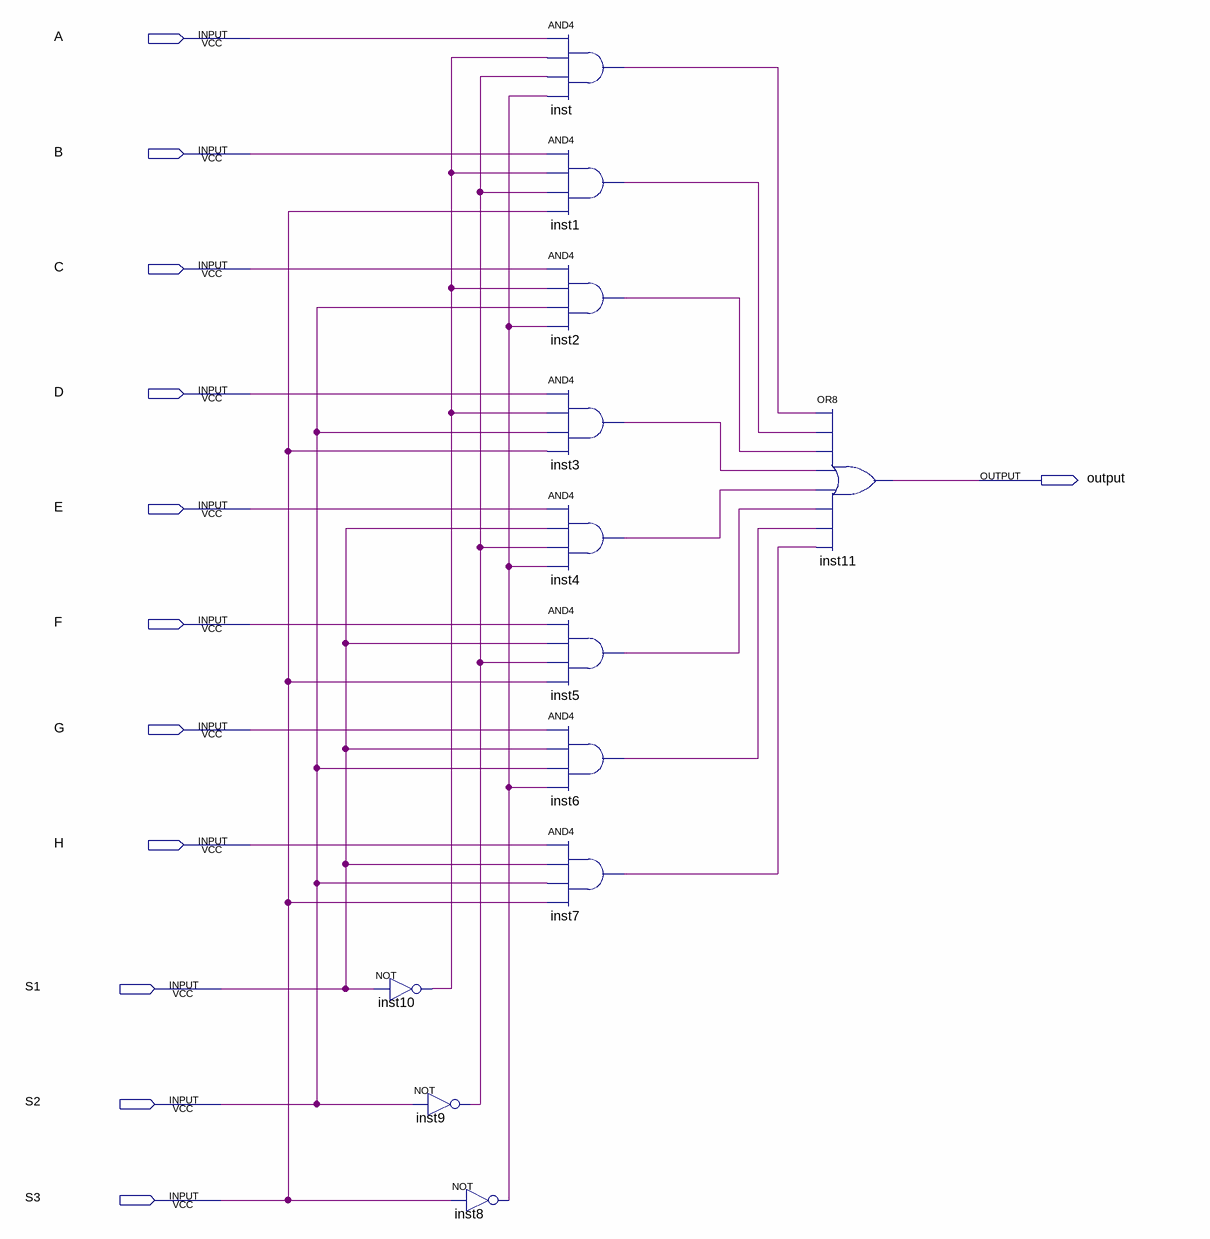
[diagram p0: schematic sheet]
// Quartus schematic 8x1mult.bdf as structural Verilog: 12 symbols, 12 pins
module \8x1mult  (
  input  A,
  input  B,
  input  C,
  input  D,
  input  E,
  input  F,
  input  G,
  input  H,
  input  S1,
  input  S2,
  input  S3,
  output \output 
);

  wire inst1_out, inst2_out, inst3_out, inst4_out, inst5_out, inst6_out, inst7_out, inst8_out, inst9_out,
       inst10_out, inst_out;

  not inst10 (inst10_out, S1);
  not inst9 (inst9_out, S2);
  not inst8 (inst8_out, S3);
  and inst (inst_out, A, inst10_out, inst9_out, inst8_out);
  and inst1 (inst1_out, B, inst10_out, inst9_out, S3);
  and inst2 (inst2_out, C, inst10_out, S2, inst8_out);
  and inst3 (inst3_out, D, inst10_out, S2, S3);
  and inst4 (inst4_out, E, S1, inst9_out, inst8_out);
  and inst5 (inst5_out, F, S1, inst9_out, S3);
  and inst6 (inst6_out, G, S1, S2, inst8_out);
  and inst7 (inst7_out, H, S1, S2, S3);
  or inst11 (\output , inst_out, inst1_out, inst2_out, inst3_out, inst4_out, inst5_out, inst6_out, inst7_out);
endmodule
